# EAGLE design PCB-Principal (EAGLE 7.2.0)
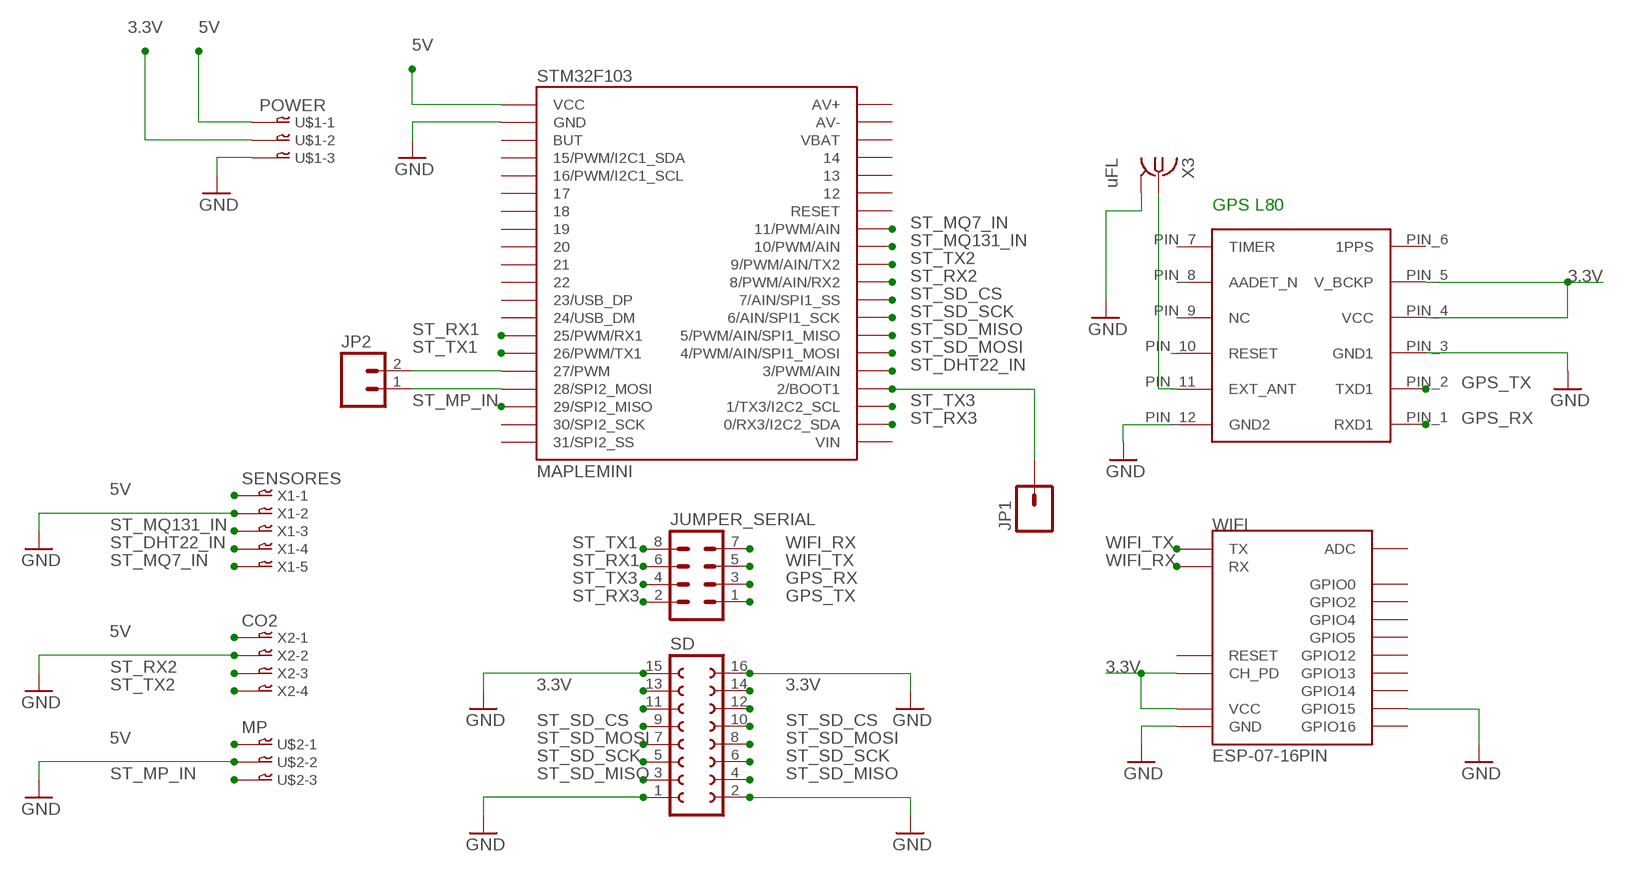
[diagram p0: schematic, sheet 1]

## Parts
GPS1  GPSL80  [L80]
JP1  M01PTH_LONGPAD  [1X01_LONGPAD]
JP2  M02PTH3  [1X02_LONGPADS]
JUMPER_SERIAL  MA04-2  [MA04-2]
SD  FE08-2  [FE08-2]
STM32F103  MAPLEMINI  [20-DIP]
U$1  POWER  03-JST-B3B-XH-A  [B3B-XH]
U$2  MP  03-JST-B3B-XH-A  [B3B-XH]
WIFI  ESP-07-16PIN  [ESP-07-16PIN]
X1  SENSORES  05-JST-B5B-XH-A  [B5B-XH]
X2  CO2  04-JST-B4B-XH-A  [B4B-XH]
X3  uFL  IPEX-20279-001E  [IPEX-20279-001E]

## Nets
3.3V: GPS1.PIN_4(VCC) GPS1.PIN_5(V_BCKP) SD.13 SD.14 U$1.P$2 WIFI.CH_PD WIFI.VCC
5V: STM32F103.1(VCC) U$1.P$1 U$2.P$1 X1.P$1 X2.P$1
GND: GPS1.PIN_3(GND1) GPS1.PIN_12(GND2) SD.1 SD.2 SD.15 SD.16 STM32F103.2(GND) U$1.P$3 U$2.P$2 WIFI.GND WIFI.GPIO15 X1.P$2 X2.P$2 X3.2@1(GND) X3.2@2(GND)
GPS_RX: GPS1.PIN_1(RXD1) JUMPER_SERIAL.3
GPS_TX: GPS1.PIN_2(TXD1) JUMPER_SERIAL.1
N$1: JP1.1 STM32F103.24(2/BOOT1)
N$2: GPS1.PIN_11(EXT_ANT) X3.1
N$3: JP2.2 STM32F103.16(27/PWM)
N$4: JP2.1 STM32F103.17(28/SPI2_MOSI)
N$8: SD.12
N$15: SD.11
ST_DHT22_IN: STM32F103.25(3/PWM/AIN) X1.P$4
ST_MP_IN: STM32F103.18(29/SPI2_MISO) U$2.P$3
ST_MQ7_IN: STM32F103.33(11/PWM/AIN) X1.P$5
ST_MQ131_IN: STM32F103.32(10/PWM/AIN) X1.P$3
ST_RX1: JUMPER_SERIAL.6 STM32F103.14(25/PWM/RX1)
ST_RX2: STM32F103.30(8/PWM/AIN/RX2) X2.P$3
ST_RX3: JUMPER_SERIAL.2 STM32F103.22(0/RX3/I2C2_SDA)
ST_SD_CS: SD.9 SD.10 STM32F103.29(7/AIN/SPI1_SS)
ST_SD_MISO: SD.3 SD.4 STM32F103.27(5/PWM/AIN/SPI1_MISO)
ST_SD_MOSI: SD.7 SD.8 STM32F103.26(4/PWM/AIN/SPI1_MOSI)
ST_SD_SCK: SD.5 SD.6 STM32F103.28(6/AIN/SPI1_SCK)
ST_TX1: JUMPER_SERIAL.8 STM32F103.15(26/PWM/TX1)
ST_TX2: STM32F103.31(9/PWM/AIN/TX2) X2.P$4
ST_TX3: JUMPER_SERIAL.4 STM32F103.23(1/TX3/I2C2_SCL)
WIFI_RX: JUMPER_SERIAL.7 WIFI.RX
WIFI_TX: JUMPER_SERIAL.5 WIFI.TX
Unconnected: GPS1.PIN_6(1PPS) GPS1.PIN_7(TIMER) GPS1.PIN_8(AADET_N) GPS1.PIN_9(NC) GPS1.PIN_10(RESET) STM32F103.3(BUT) STM32F103.4(15/PWM/I2C1_SDA) STM32F103.5(16/PWM/I2C1_SCL) STM32F103.6 STM32F103.7 STM32F103.8 STM32F103.9 STM32F103.10 STM32F103.11 STM32F103.12(23/USB_DP) STM32F103.13(24/USB_DM) STM32F103.19(30/SPI2_SCK) STM32F103.20(31/SPI2_SS) STM32F103.21(VIN) STM32F103.34(RESET) STM32F103.35 STM32F103.36 STM32F103.37 STM32F103.38(VBAT) STM32F103.39(AV-) STM32F103.40(AV+) WIFI.ADC WIFI.GPIO0 WIFI.GPIO2 WIFI.GPIO4 WIFI.GPIO5 WIFI.GPIO12 WIFI.GPIO13 WIFI.GPIO14 WIFI.GPIO16 WIFI.REST(RESET)

## Notes on the sheet
- GPS L80

## Library data of the parts
GPS1 = GPSL80:GPSL80
JP1 = SparkFun-Connectors:M01: Header 1 Standard 1-pin 0.1" header. Use with straight break away headers (SKU : PRT-00116), right angle break away headers (PRT-00553), swiss pins (PRT-00743), machine pins (PRT-00117), and female headers (PRT-00115).
JP2 = SparkFun-Connectors:M02: Standard 2-pin 0.1" header. Use with - straight break away headers ( PRT-00116) - right angle break away headers (PRT-00553) - swiss pins (PRT-00743) - machine pins (PRT-00117) - female headers (PRT-00115) Molex polarized connector foot print use with: PRT-08233 with associated crimp pins and housings. 2.54_SCREWTERM for use with PRT-10571. 3.5mm Screw Terminal footprints for PRT-08084 5mm Screw Terminal footprints for use with PRT-08432
JUMPER_SERIAL = con-lstb:MA04-2: PIN HEADER; OC_FARNELL: unknown; OC_NEWARK: unknown
SD = con-lsta:FE08-2: FEMALE HEADER; OC_FARNELL: unknown; OC_NEWARK: unknown
STM32F103 = maplemini:MAPLEMINI
U$1 U$2 = bt_con-jst-xh:03-JST: JST CONNECTOR
WIFI = esp8266modules:ESP-07-16PIN: ESP8266 Wifi Module ESP-07 - 16 pins; DIMENSIONS: 22.0 x 16.0 mm; PINS: 16; PITCH: 0.078" / 2 mm
X1 = bt_con-jst-xh:05-JST: JST CONNECTOR
X2 = bt_con-jst-xh:04-JST: JST CONNECTOR
X3 = Spark:IPEX-20279-001E: Ultra Miniature Coaxial SMT RF Receptacle

## Board
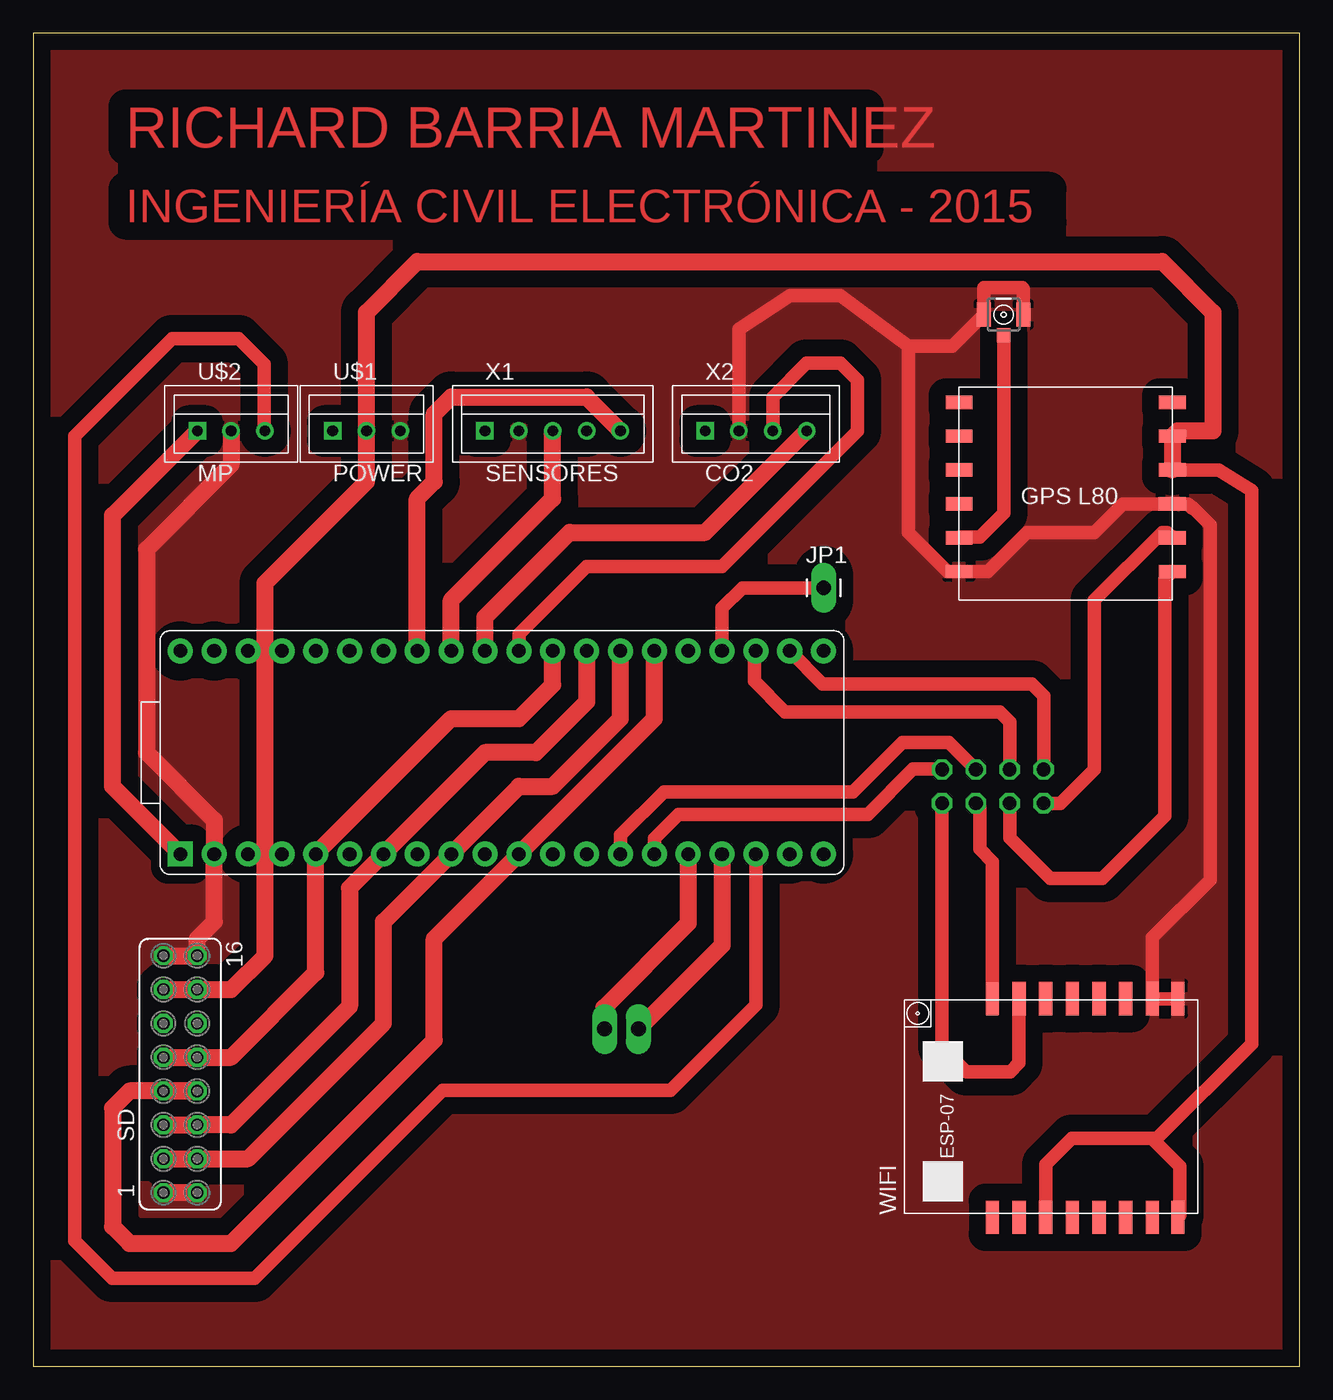
[diagram p1: board, top side]
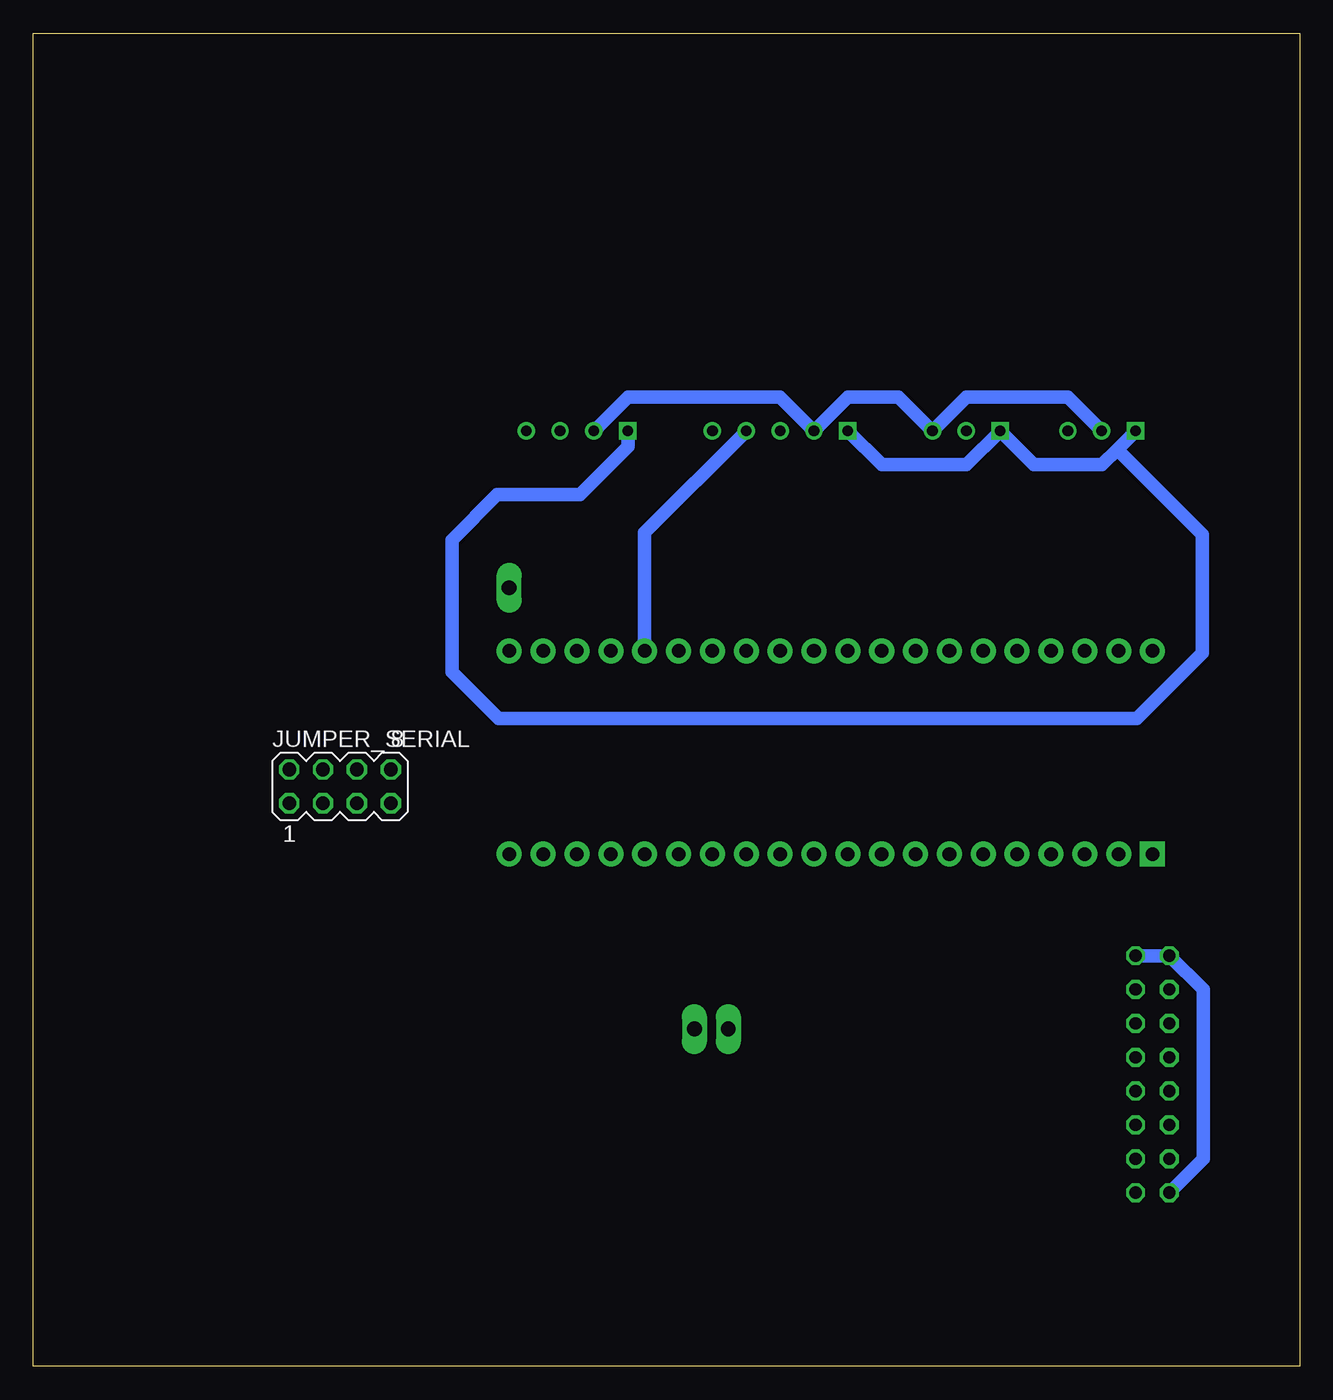
[diagram p2: board, bottom side, seen from below]

Size 95 x 100 mm. Coordinates in mm from the lower left corner, seen from the top.
Outline: 0,0 95,0 95,100 0,100 0,0
Copper layers (1*16): Top 0.035mm / dielectric 1.5mm / Bottom 0.035mm
Design rules "default": minimum track width 10mil, minimum drill 24mil, track to track 8mil, track to pad 8mil, pad to pad 8mil, via to via 8mil, smd to smd 8mil, copper to edge 40mil, drill to drill 8mil, minimum pad ring 10mil, minimum via ring 8mil, stop-mask expansion 4mil, vias tented up to drill 0mil, thermal gap 10mil

### Footprints (pad centres in the part's own frame; a part is rotated, then mirrored left to right if it is on the bottom)
L80 = smd 2 x 1: PIN_1 16,2.15; PIN_2 16,4.69; PIN_3 16,7.23; PIN_4 16,9.77; PIN_5 16,12.31; PIN_6 16,14.85; PIN_7 0,14.85; PIN_8 0,12.31; PIN_9 0,9.77; PIN_10 0,7.23; PIN_11 0,4.69; PIN_12 0,2.15
1X01_LONGPAD = drill 1.118 pad 1.88 long: 1 0,0
1X02_LONGPADS = drill 1.118 pad 1.88 long: 1 0,0; 2 2.54,0
MA04-2 = drill 1.016 octagon: 1 -3.81,-1.27; 2 -3.81,1.27; 3 -1.27,-1.27; 4 -1.27,1.27; 5 1.27,-1.27; 6 1.27,1.27; 7 3.81,-1.27; 8 3.81,1.27
FE08-2 = drill 0.914 octagon: 1 -8.89,1.27; 2 -8.89,-1.27; 3 -6.35,1.27; 4 -6.35,-1.27; 5 -3.81,1.27; 6 -3.81,-1.27; 7 -1.27,1.27; 8 -1.27,-1.27; 9 1.27,1.27; 10 1.27,-1.27; 11 3.81,1.27; 12 3.81,-1.27; 13 6.35,1.27; 14 6.35,-1.27; 15 8.89,1.27; 16 8.89,-1.27
20-DIP = drill 1.016 pad 1.88 square: 1 -24.13,-7.62 | drill 1.016 pad 1.88: 2 -21.59,-7.62; 3 -19.05,-7.62; 4 -16.51,-7.62; 5 -13.97,-7.62; 6 -11.43,-7.62; 7 -8.89,-7.62; 8 -6.35,-7.62; 9 -3.81,-7.62; 10 -1.27,-7.62; 11 1.27,-7.62; 12 3.81,-7.62; 13 6.35,-7.62; 14 8.89,-7.62; 15 11.43,-7.62; 16 13.97,-7.62; 17 16.51,-7.62; 18 19.05,-7.62; 19 21.59,-7.62; 20 24.13,-7.62; 21 24.13,7.62; 22 21.59,7.62; 23 19.05,7.62; 24 16.51,7.62; 25 13.97,7.62; 26 11.43,7.62; 27 8.89,7.62; 28 6.35,7.62; 29 3.81,7.62; 30 1.27,7.62; 31 -1.27,7.62; 32 -3.81,7.62; 33 -6.35,7.62; 34 -8.89,7.62; 35 -11.43,7.62; 36 -13.97,7.62; 37 -16.51,7.62; 38 -19.05,7.62; 39 -21.59,7.62; 40 -24.13,7.62
B3B-XH = drill 0.8 square: P$1 -2.54,0 | drill 0.8: P$2 0,0; P$3 2.54,0
ESP-07-16PIN = smd 2.5 x 1: ADC -8.2,3.8; CH_PD -8.2,1.8; GND 8.2,-8.105; GPIO0 8.2,-2.2; GPIO2 8.2,-4.2; GPIO4 8.2,1.8; GPIO5 8.2,-0.2; GPIO12 -8.2,-4.2; GPIO13 -8.2,-6.2; GPIO14 -8.2,-2.2; GPIO15 8.2,-6.2; GPIO16 -8.2,-0.2; REST -8.2,5.8; RX 8.2,3.8; TX 8.2,5.8; VCC -8.2,-8.105
B5B-XH = drill 0.8 square: P$1 -5.08,0 | drill 0.8: P$2 -2.54,0; P$3 0,0; P$4 2.54,0; P$5 5.08,0
B4B-XH = drill 0.8 square: P$1 -3.81,0 | drill 0.8: P$2 -1.27,0; P$3 1.27,0; P$4 3.81,0
IPEX-20279-001E = smd 1 x 1.05: 1 0,1.528 | smd 1.05 x 1.8: 2@1 -1.475,0; 2@2 1.475,0

### Placement (x,y rotation side)
GPS1  69.45,57.47 0 top
JP1  59.3,58.4 0 top
JP2  45.4,25.3 180 top
JUMPER_SERIAL  71.99,43.5 0 bottom
SD  11.03,21.91 90 top
STM32F103  35.16,46.04 0 top
U$1  25,70.17 0 top
U$2  14.84,70.17 0 top
WIFI  77.76,19.37 90 top
X1  38.97,70.17 0 top
X2  54.21,70.17 0 top
X3  72.8,78.9 180 top

### Tracks (layer width: path | path; a pad name or v marks a point on that pad's centre or on a via)
3.3V
  Top 1.016: WIFI.CH_PD 75.96,15.16 77.9,17.1 83.9,17.1 | 83.9,17.1 86,15 86,11.3 WIFI.VCC | GPS1.PIN_4 88.96,67.24 91.4,65.7 91.4,24.2 84.3,17.1 83.9,17.1
  Top 1.27: SD.13 SD.14 14.84,28.26 17.38,30.8 17.38,58.74 25,66.36 U$1.P$2 25,79.06 28.81,82.87 84.69,82.87 88.5,79.06 88.5,70.17 85.84,70.17 GPS1.PIN_5 GPS1.PIN_4
5V
  Top 1.27: STM32F103.1 5.95,43.5 5.95,63.82 U$2.P$1
  Bottom 1.016: U$2.P$1 13.69,68.78 | 13.69,68.78 14.84,67.63 19.92,67.63 U$1.P$1 25,67.63 31.35,67.63 X1.P$1 | X2.P$1 50.4,69 54,65.4 60.2,65.4 63.6,62 63.6,52.1 60.1,48.6 12.2,48.6 7.3,53.5 7.3,62.4 13.69,68.78
GND
  Top 1.016: WIFI.GND WIFI.GPIO15 83.96,32.16 88.3,36.5 88.3,63.1 87,64.4 86.9,64.4 86.6,64.7 GPS1.PIN_3 81.76,64.7 79.61,62.55 74.53,62.55 71.6,59.62 GPS1.PIN_12 68.57,59.62 65.64,62.55 65.64,76.52 | 65.64,76.52 60.56,80.33 56.75,80.33 52.94,77.79 X2.P$2 | 65.64,76.52 68.94,76.52 X3.2@2 71.3,78.92 71.3,80.9 74.2,80.9 74.28,80.83 X3.2@1
  Top 1.27: SD.15 SD.16 12.3,32.07 13.57,33.34 STM32F103.2 13.57,40.96 8.49,46.04 8.49,61.28 14.84,67.63 U$2.P$2 | SD.2 SD.1
  Bottom 1.016: U$2.P$2 17.38,72.71 25,72.71 U$1.P$3 30.08,72.71 33.89,72.71 X1.P$2 38.97,72.71 50.4,72.71 X2.P$2 | SD.16 SD.15 7.22,28.26 7.22,15.56 SD.1
  pour Top (isolate 1.27): 0,100 95,100 95,0 0,0
GPS_RX
  Top 1.016: JUMPER_SERIAL.3 73.26,39.64 76.3,36.6 80.2,36.6 84.9,41.3 84.9,59.07 GPS1.PIN_1
GPS_TX
  Top 1.016: JUMPER_SERIAL.1 77.07,42.23 79.61,44.77 79.61,57.47 84.69,62.55 85.06,62.55 GPS1.PIN_2
N$1
  Top 1.016: STM32F103.24 51.67,56.87 53.2,58.4 JP1.1
N$2
  Top 1.016: X3.1 72.8,64 71,62.2 69.49,62.2 GPS1.PIN_11
N$3
  Top 1.27: STM32F103.16 49.13,33.23 42.8,26.9 42.8,25.36 JP2.2
N$4
  Top 1.27: STM32F103.17 51.67,31.57 JP2.1
ST_DHT22_IN
  Bottom 1.016: STM32F103.25 49.13,62.55 X1.P$4
ST_MP_IN
  Top 1.016: STM32F103.18 54.21,27.11 47.8,20.7 30.7,20.7 16.6,6.6 5.9,6.6 3.1,9.4 3.1,69.8 10.4,77.1 15.4,77.1 17.3,75.2 17.3,70.25 U$2.P$3
ST_MQ7_IN
  Top 1.27: STM32F103.33 28.81,65.09 30.08,66.36 30.08,71.44 31.35,72.71 41.51,72.71 X1.P$5
ST_MQ131_IN
  Top 1.27: STM32F103.32 31.35,57.47 38.97,65.09 X1.P$3
ST_RX1
  Top 1.016: STM32F103.14 44.05,39.85 47.3,43.1 61.5,43.1 65.2,46.8 68.69,46.8 JUMPER_SERIAL.6
ST_RX2
  Top 1.016: STM32F103.30 36.43,54.93 41.51,60.01 51.67,60.01 61.83,70.17 61.83,73.98 60.56,75.25 58.02,75.25 55.48,72.71 X2.P$3
ST_RX3
  Top 1.016: JUMPER_SERIAL.2 75.8,50.3 74.9,51.2 59.21,51.2 STM32F103.22
ST_SD_CS
  Top 1.27: SD.9 SD.10 14.84,23.18 21.19,29.53 21.19,38.42 31.35,48.58 36.43,48.58 38.97,51.12 STM32F103.29
ST_SD_MISO
  Top 1.27: SD.3 SD.4 16.11,15.56 26.27,25.72 26.27,33.34 36.43,43.5 38.97,43.5 44.05,48.58 STM32F103.27
ST_SD_MOSI
  Top 1.27: SD.7 SD.8 7.22,20.64 5.95,19.37 5.95,10.48 7.22,9.21 14.84,9.21 30.08,24.45 30.08,32.07 46.59,48.58 STM32F103.26
ST_SD_SCK
  Top 1.27: SD.5 SD.6 14.84,18.1 23.73,26.99 23.73,35.88 33.89,46.04 37.7,46.04 41.51,49.85 STM32F103.28
ST_TX1
  Top 1.016: STM32F103.15 46.59,39.59 48.4,41.4 62.6,41.4 66,44.8 68.15,44.8 JUMPER_SERIAL.8
ST_TX2
  Top 1.27: STM32F103.31 33.89,56.2 40.24,62.55 50.4,62.55 X2.P$4
ST_TX3
  Top 1.016: JUMPER_SERIAL.4 73.26,48.34 72.5,49.1 56.4,49.1 54.1,51.4 54.1,53.55 STM32F103.23
WIFI_RX
  Top 1.016: JUMPER_SERIAL.7 68.18,23.92 70,22.1 73.3,22.1 73.96,22.76 WIFI.RX
WIFI_TX
  Top 1.016: WIFI.TX 71.96,37.84 71,38.8 71,41.95 JUMPER_SERIAL.5

### Text on the board
Top: RICHARD BARRIA MARTINEZ | INGENIERÍA CIVIL ELECTRÓNICA - 2015